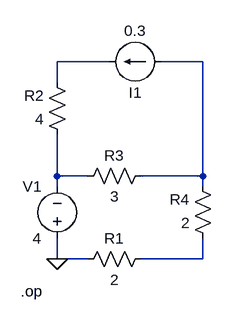
[diagram p0: schematic Draft2.asc]
Draft2.asc, the LTspice schematic file:
Version 4
SHEET 1 880 680
WIRE 144 -16 64 -16
WIRE 288 -16 224 -16
WIRE 64 16 64 -16
WIRE 64 160 64 96
WIRE 112 160 64 160
WIRE 288 160 288 -16
WIRE 288 160 192 160
WIRE 64 176 64 160
WIRE 288 176 288 160
WIRE 64 288 64 256
WIRE 112 288 64 288
WIRE 288 288 288 256
WIRE 288 288 192 288
FLAG 64 288 0
SYMBOL res 208 272 R90
WINDOW 0 0 56 VBottom 2
WINDOW 3 32 56 VTop 2
SYMATTR InstName R1
SYMATTR Value 2
SYMBOL res 80 112 R180
WINDOW 0 36 76 Left 2
WINDOW 3 36 40 Left 2
SYMATTR InstName R2
SYMATTR Value 4
SYMBOL res 96 176 R270
WINDOW 0 32 56 VTop 2
WINDOW 3 0 56 VBottom 2
SYMATTR InstName R3
SYMATTR Value 3
SYMBOL res 304 272 R180
WINDOW 0 36 76 Left 2
WINDOW 3 36 40 Left 2
SYMATTR InstName R4
SYMATTR Value 2
SYMBOL voltage 64 272 R180
WINDOW 0 24 96 Left 2
WINDOW 3 24 16 Left 2
WINDOW 123 0 0 Left 0
WINDOW 39 0 0 Left 0
SYMATTR InstName V1
SYMATTR Value 4
SYMBOL current 224 -16 R90
WINDOW 0 32 40 VTop 2
WINDOW 3 -32 40 VBottom 2
WINDOW 123 0 0 Left 0
WINDOW 39 0 0 Left 0
SYMATTR InstName I1
SYMATTR Value 0.3
TEXT 8 338 Left 2 !.op

The netlist it stands for:
* Draft2.asc
R1 N004 0 2
R2 N003 N001 4
R3 N003 N002 3
R4 N004 N002 2
V1 0 N003 4
I1 N002 N001 0.3
.op
.backanno
.end